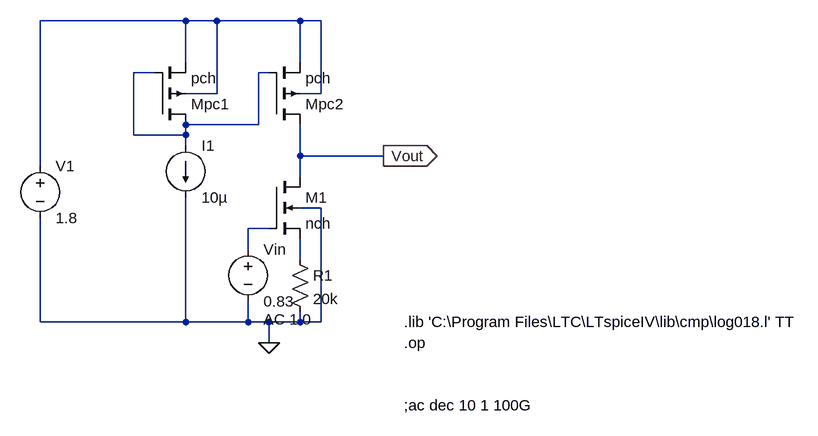
[diagram p0: schematic Week2_Exc2_v2.asc]
Week2_Exc2_v2.asc, the LTspice schematic file:
Version 4
SHEET 1 1108 680
WIRE 64 -32 -160 -32
WIRE 112 -32 64 -32
WIRE 240 -32 112 -32
WIRE 272 -32 240 -32
WIRE 64 32 64 -32
WIRE 240 32 240 -32
WIRE 16 48 -16 48
WIRE 192 48 176 48
WIRE 112 80 112 -32
WIRE 112 80 64 80
WIRE 272 80 272 -32
WIRE 272 80 240 80
WIRE 176 128 176 48
WIRE 176 128 64 128
WIRE -16 144 -16 48
WIRE 64 144 64 128
WIRE 64 144 -16 144
WIRE 64 160 64 144
WIRE 240 176 240 128
WIRE 368 176 240 176
WIRE -160 192 -160 -32
WIRE 240 208 240 176
WIRE 272 256 240 256
WIRE 192 288 160 288
WIRE 160 320 160 288
WIRE 240 336 240 304
WIRE -160 432 -160 272
WIRE 64 432 64 240
WIRE 64 432 -160 432
WIRE 160 432 160 400
WIRE 160 432 64 432
WIRE 192 432 160 432
WIRE 240 432 240 416
WIRE 240 432 192 432
WIRE 272 432 272 256
WIRE 272 432 240 432
WIRE 192 464 192 432
FLAG 192 464 0
FLAG 368 176 Vout
IOPIN 368 176 Out
DATAFLAG 304 176 ""
SYMBOL nmos4 192 208 R0
SYMATTR InstName M1
SYMATTR Value nch
SYMATTR Value2 l=0.18u w=1u m=1
SYMBOL pmos4 192 128 M180
SYMATTR InstName Mpc2
SYMATTR Value pch
SYMATTR Value2 l=1u w=1u
SYMBOL pmos4 16 128 M180
SYMATTR InstName Mpc1
SYMATTR Value pch
SYMATTR Value2 l=1u w=1u
SYMBOL current 64 160 R0
WINDOW 123 0 0 Left 0
WINDOW 39 0 0 Left 0
SYMATTR InstName I1
SYMATTR Value 10µ
SYMBOL voltage 160 304 R0
WINDOW 123 24 124 Left 2
WINDOW 39 0 0 Left 0
SYMATTR Value2 AC 1 0
SYMATTR InstName Vin
SYMATTR Value 0.83
SYMBOL voltage -160 176 R0
WINDOW 123 0 0 Left 0
WINDOW 39 0 0 Left 0
SYMATTR InstName V1
SYMATTR Value 1.8
SYMBOL res 224 320 R0
SYMATTR InstName R1
SYMATTR Value 20k
TEXT 400 464 Left 2 !.op
TEXT 400 432 Left 2 !.lib 'C:\\Program Files\\LTC\\LTspiceIV\\lib\\cmp\\log018.l' TT
TEXT 400 560 Left 2 !;ac dec 10 1 100G

The netlist it stands for:
* Week2_Exc2_v2.asc
M1 Vout N003 N004 0 nch l=0.18u w=1u m=1
Mpc2 Vout N002 N001 N001 pch l=1u w=1u
Mpc1 N002 N002 N001 N001 pch l=1u w=1u
I1 N002 0 10µ
Vin N003 0 0.83 AC 1 0
V1 N001 0 1.8
R1 N004 0 20k
.model NMOS NMOS
.model PMOS PMOS
.lib standard.mos
.op
.lib 'C:\Program Files\LTC\LTspiceIV\lib\cmp\log018.l' TT
;ac dec 10 1 100G
.backanno
.end